# EAGLE design Tricorder-BoosterPack (EAGLE 7.2.0)
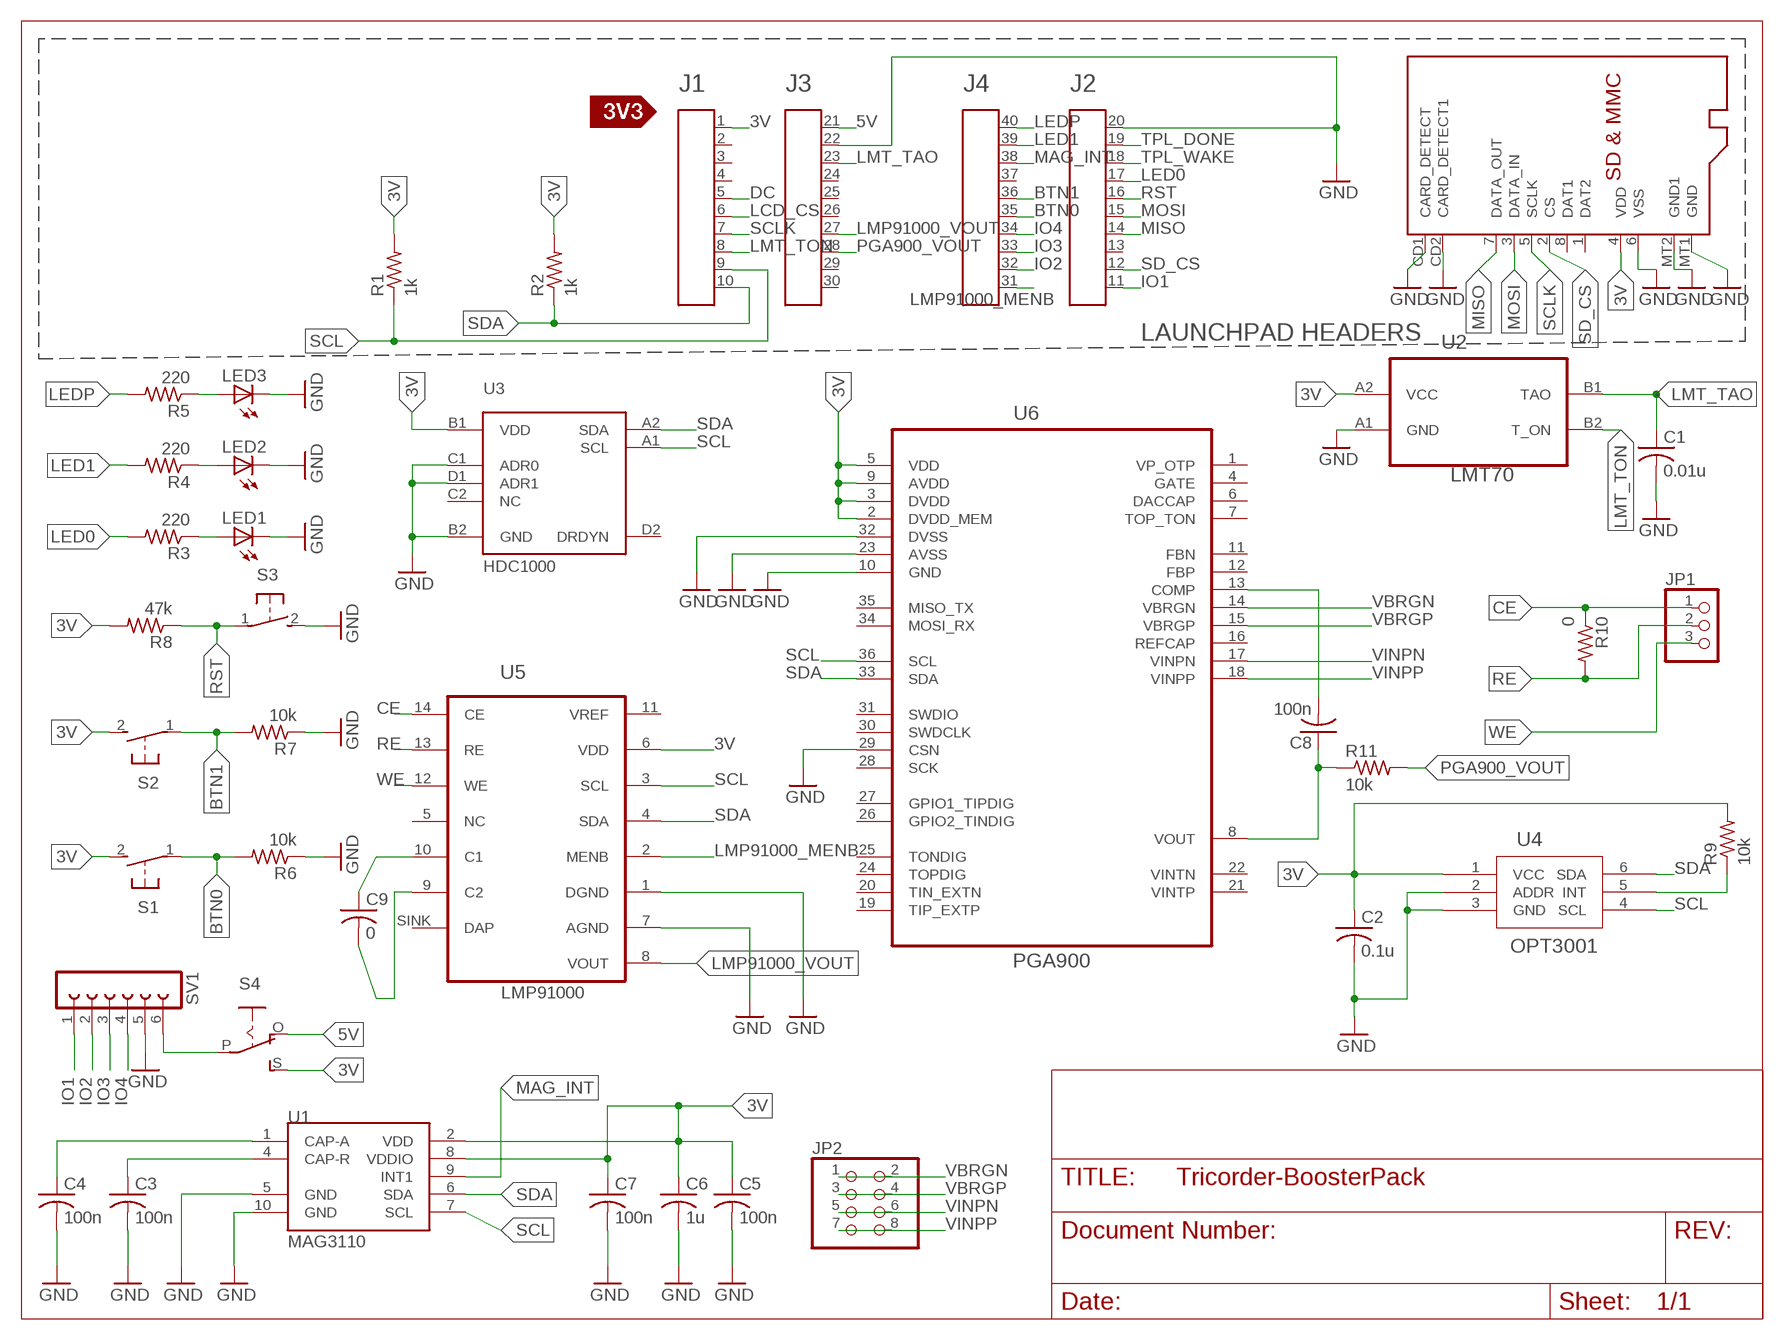
[diagram p0: schematic, sheet 1]

## Parts
A1  HEADER4X10-BOOSTERPACK  [4X10-BOOSTERPACK]
C1  0.01u  C-USC0603  [C0603]
C2  0.1u  C-USC0603  [C0603]
C3  100n  C-USC0603  [C0603]
C4  100n  C-USC0603  [C0603]
C5  100n  C-USC0603  [C0603]
C6  1u  C-USC0603  [C0603]
C7  100n  C-USC0603  [C0603]
C8  100n  C-USC0603  [C0603]
C9  0  C-USC0603  [C0603]
JP1  PINHD-1X3CB  [1X03-CLEANBIG]
JP2  PINHD-2X4  [2X04]
LED1  LEDCHIPLED_0603  [CHIPLED_0603]
LED2  LEDCHIPLED_0603  [CHIPLED_0603]
LED3  LEDCHIPLED_0603  [CHIPLED_0603]
R1  1k  R-US_R0603  [R0603]
R2  1k  R-US_R0603  [R0603]
R3  220  R-US_R0603  [R0603]
R4  220  R-US_R0603  [R0603]
R5  220  R-US_R0603  [R0603]
R6  10k  R-US_R0603  [R0603]
R7  10k  R-US_R0603  [R0603]
R8  47k  R-US_R0603  [R0603]
R9  10k  R-US_R0603  [R0603]
R10  0  R-US_R0603  [R0603]
R11  10k  R-US_R0603  [R0603]
S1  31-XX  [B3F-31XX]
S2  31-XX  [B3F-31XX]
S3  31-XX  [B3F-31XX]
S4  EG1218S  [EG1218]
SV1  FE06-1  [FE06]
U1  MAG3110  [DFN-10]
U2  LMT70LMT70  [BGA4C40P2X2_77X77X50]
U3  HDC1000  [DSBGA_8_YPA]
U4  OPT3001  [DPK6]
U5  LMP91000  [WFDFN-14]
U6  PGA900  [QFN50P600X600X90-37N]
U7  MICROSD  [MICROSD]
U$3  SILK_3V3_TAG  [SILK_3V3_TAG]

## Nets
3V: A1.1 C2.1 C5.1 C6.1 C7.1 R1.2 R2.2 R8.2 R9.2 S1.2(S) S2.2(S) S4.S U1.2(VDD) U1.8(VDDIO) U2.A2(VCC) U3.B1(VDD) U4.1(VCC) U5.6(VDD) U6.2(DVDD_MEM) U6.3(DVDD) U6.5(VDD) U6.9(AVDD) U7.4(VDD)
5V: A1.21 S4.O
BTN0: A1.35 R6.2 S1.1(P)
BTN1: A1.36 R7.2 S2.1(P)
CE: JP1.1 R10.1 U5.14(CE)
DC: A1.5
GND: A1.20 A1.22 C1.2 C2.2 C3.2 C4.2 C5.2 C6.2 C7.2 LED1.C LED2.C LED3.C R6.1 R7.1 S3.2(S) SV1.5 U1.5(GND) U1.10(GND) U2.A1(GND) U3.B2(GND) U3.C1(ADR0) U3.D1(ADR1) U4.2(ADDR) U4.3(GND) U5.1(DGND) U5.7(AGND) U6.10(GND) U6.23(AVSS) U6.29(CSN) U6.32(DVSS) U7.6(VSS) U7.CD1(CARD_DETECT) U7.CD2(CARD_DETECT1) U7.MT1(GND) U7.MT2(GND1)
IO1: A1.11 SV1.1
IO2: A1.32 SV1.2
IO3: A1.33 SV1.3
IO4: A1.34 SV1.4
LCD_CS: A1.6
LED0: A1.17 R3.2
LED1: A1.39 R4.2
LEDP: A1.40 R5.2
LMP91000_MENB: A1.31 U5.2(MENB)
LMP91000_VOUT: A1.27 U5.8(VOUT)
LMT_TAO: A1.23 C1.1 U2.B1(TAO)
LMT_TON: A1.8 U2.B2(T_ON)
MAG_INT: A1.38 U1.9(INT1)
MISO: A1.14 U7.7(DATA_OUT)
MOSI: A1.15 U7.3(DATA_IN)
N$1: LED1.A R3.1
N$2: LED2.A R4.1
N$3: LED3.A R5.1
N$4: S4.P SV1.6
N$5: R9.1 U4.5(INT)
N$7: C9.1 U5.10(C1)
N$8: C3.1 U1.4(CAP-R)
N$9: C4.1 U1.1(CAP-A)
N$10: C8.2 U6.13(COMP)
N$11: C9.2 U5.9(C2)
N$12: C8.1 R11.1 U6.8(VOUT)
PGA900_VOUT: A1.28 R11.2
RE: JP1.2 R10.2 U5.13(RE)
RST: A1.16 R8.1 S3.1(P)
SCL: A1.9 R1.1 U1.7(SCL) U3.A1(SCL) U4.4(SCL) U5.3(SCL) U6.36(SCL)
SCLK: A1.7 U7.5(SCLK)
SD_CS: A1.12 U7.2(CS)
SDA: A1.10 R2.1 U1.6(SDA) U3.A2(SDA) U4.6(SDA) U5.4(SDA) U6.33(SDA)
TPL_DONE: A1.19
TPL_WAKE: A1.18
VBRGN: JP2.1 JP2.2 U6.14(VBRGN)
VBRGP: JP2.3 JP2.4 U6.15(VBRGP)
VINPN: JP2.5 JP2.6 U6.17(VINPN)
VINPP: JP2.7 JP2.8 U6.18(VINPP)
WE: JP1.3 U5.12(WE)
Unconnected: A1.2 A1.3 A1.4 A1.13 A1.24 A1.25 A1.26 A1.29 A1.30 A1.37 U3.C2(NC) U3.D2(DRDYN) U5.5(NC) U5.SINK(DAP) U6.1(VP_OTP) U6.4(GATE) U6.6(DACCAP) U6.7(TOP_TON) U6.11(FBN) U6.12(FBP) U6.16(REFCAP) U6.19(TIP_EXTP) U6.20(TIN_EXTN) U6.21(VINTP) U6.22(VINTN) U6.24(TOPDIG) U6.25(TONDIG) U6.26(GPIO2_TINDIG) U6.27(GPIO1_TIPDIG) U6.28(SCK) U6.30(SWDCLK) U6.31(SWDIO) U6.34(MOSI_RX) U6.35(MISO_TX) U7.1(DAT2) U7.8(DAT1)

## Notes on the sheet
- LAUNCHPAD HEADERS

## Power pins joined to a net without a drawn wire
VREF: U5.11(VREF)

## Library data of the parts
A1 = Public_BP_Library:HEADER4X10-BOOSTERPACK
C1-C9 = adafruit:C-US: CAPACITOR, American symbol
JP1 = adafruit:PINHD-1X3: PIN HEADER
JP2 = adafruit:PINHD-2X4: PIN HEADER
LED1-LED3 = adafruit:LED: LED OSRAM: - CHIPLED LG R971, LG N971, LY N971, LG Q971, LY Q971, LO R971, LY R971 LH N974, LH R974 LS Q976, LO Q976, LY Q976 LO Q996 - Hyper CHIPLED LW Q18S LB Q993, LB Q99A, LB R99A - SideLED LS A670, LO A670, LY A670, LG A670, LP A670 LB A673, LV A673, LT A673, LW A673 LH A674 LY A675 LS A676, LA A676, LO A676, LY A676, LW A676 LS A679, LY A679, LG A679 - Hyper Micro SIDELED® LS Y876, LA Y876, LO Y876, LY Y876 LT Y87S - SmartLED LW L88C, LW L88S LB L89C, LB L89S, LG L890 LS L89K, LO L89K, LY L89K LS L896, LA L896, LO L896, LY L896 - TOPLED LS T670, LO T670, LY T670, LG T670, LP T670 LSG T670, LSP T670, LSY T670, LOP T670, LYG T670 LG T671, LOG T671, LSG T671 LB T673, LV T673, LT T673, LW T673 LH T674 LS T676, LA T676, LO T676, LY T676, LB T676, LH T676, LSB T676, LW T676 LB T67C, LV T67C, LT T67C, LS T67K, LO T67K, LY T67K, LW E67C LS E67B, LA E67B, LO E67B, LY E67B, LB E67C, LV E67C, LT E67C LW T67C LS T679, LY T679, LG T679 LS T770, LO T770, LY T770, LG T770, LP T770 LB T773, LV T773, LT T773, LW T773 LH T774 LS E675, LA E675, LY E675, LS T675 LS T776, LA T776, LO T776, LY T776, LB T776 LHGB T686 LT T68C, LB T68C - Hyper Mini TOPLED® LB M676 - Mini TOPLED Santana® LG M470 LS M47K, LO M47K, LY M47K Source: http://www.osram.convergy.de/
R1-R11 = resistor:R-US_: RESISTOR, American symbol
S1-S3 = adafruit:31-XX: OMRON SWITCH Now with beefier pads!
S4 = adafruit:EG1218: SLIDING SWITCH 0.1" spacing through hole, vertical SPDT slide switch http://www.ladyada.net/library/pcb/eaglelibrary.html
SV1 = con-lsta:FE06-1: FEMALE HEADER; OC_FARNELL: unknown; OC_NEWARK: unknown
U1 = SparkFun-Sensors:MAG3110: 3-axis digital (I2C) magnetometer
U2 = LMT70:LMT70: LOW-POWER SINGLE INVERTER GATE; MPN: LMT70; OC_FARNELL: -; OC_NEWARK: 50R7866; PACKAGE: BGA-4; SUPPLIER: Texas Instruments
U3 = Fra:HDC1000
U4 = OPT3001_GOOD:OPT3001; DATASHEETURL: http://www.ti.com/lit/gpn/TPD4E001; DESCRIPTION: Low-Capacitance 4-Channel +/-15-kV ESD Protection Array for High-Speed Data Interfaces; FAMILY_NAME: ESD Solution; GENERIC_PART_NUMBER: TPD4E001; INDUSTRY_STD_PKG_TYPE: USON; MANUFACTURER: Texas Instruments; MANUFACTURER_PART_NUMBER: tpd4e001_dpk_6; PACKAGE_DESIGNATOR: DPK; PIN_COUNT: 6; VENDOR: Texas Instruments
U5 = LMP91000:LMP91000: IC TI AFE for Gas Sensing; DIGIKEY: LMP91000
U6 = PGA900:PGA900: Resistive Sensor Interface; MPN: PGA900; PACKAGE: QFN-36; SUPPLIER: TEXAS INSTRUMENTS
U7 = adafruit:MICROSD: Micro-SD / Transflash card holder with SPI pinout For the 3M # 2908-05WB-MG and/or 4UCON #19656 push-push type
U$3 = Public_BP_Library:SILK_3V3_TAG

## Net classes
0 default: width 0.15 mm, drill 0.508 mm, clearance 0.001 mm

## Board
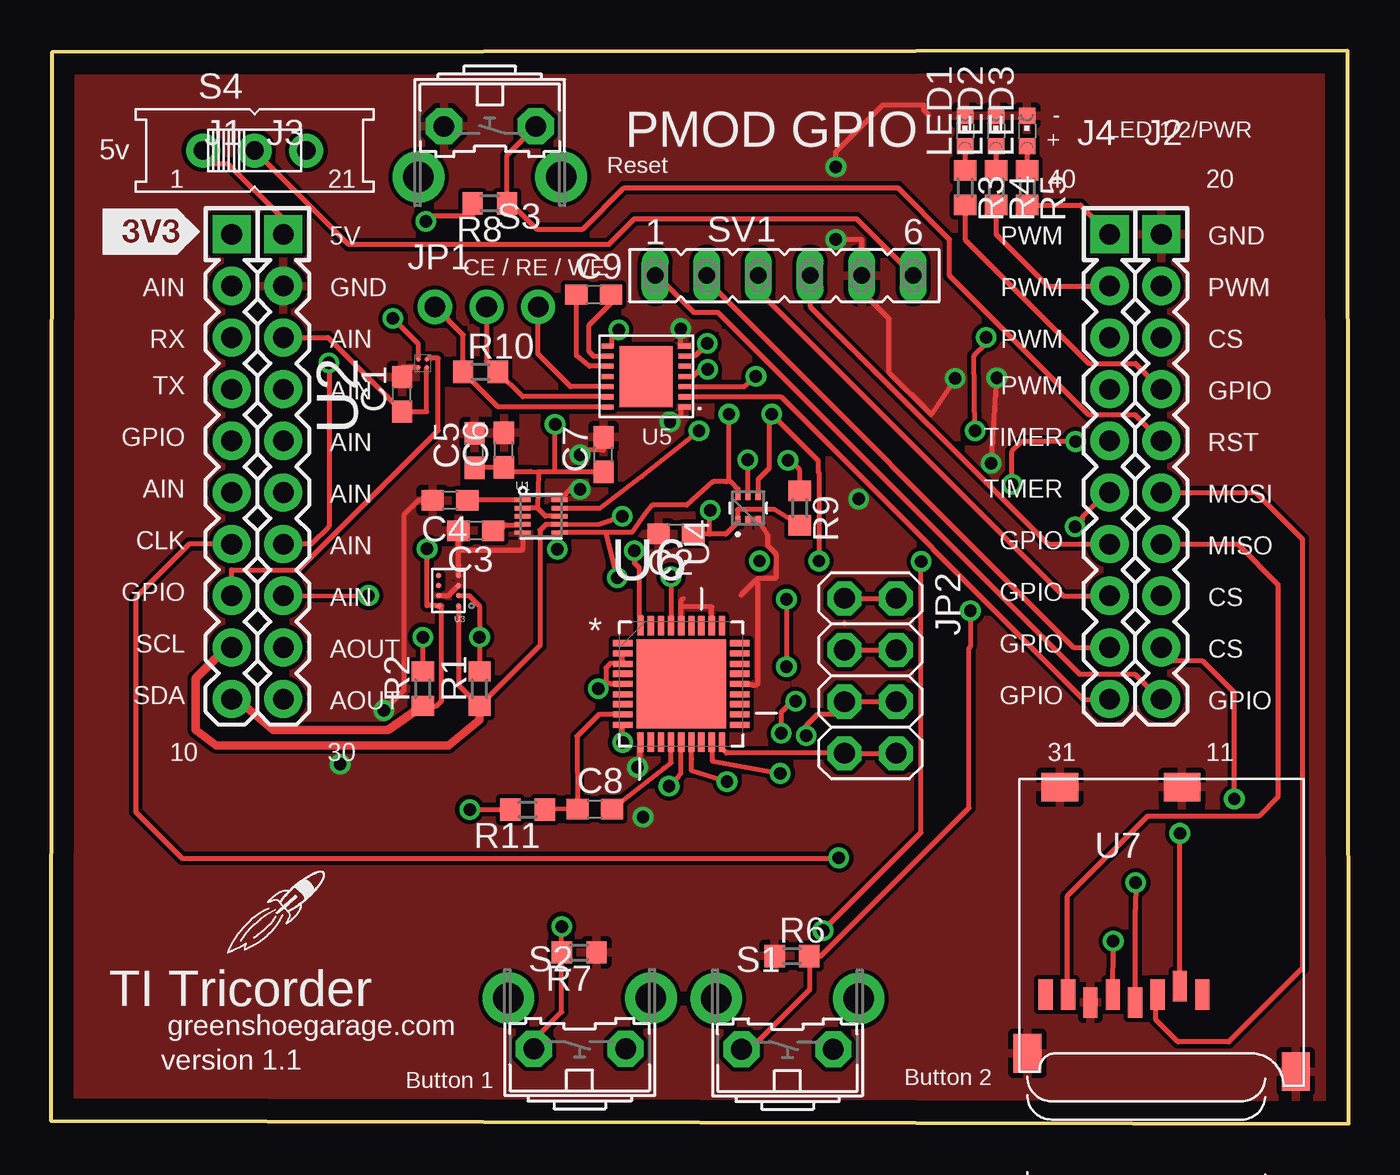
[diagram p1: board, top side]
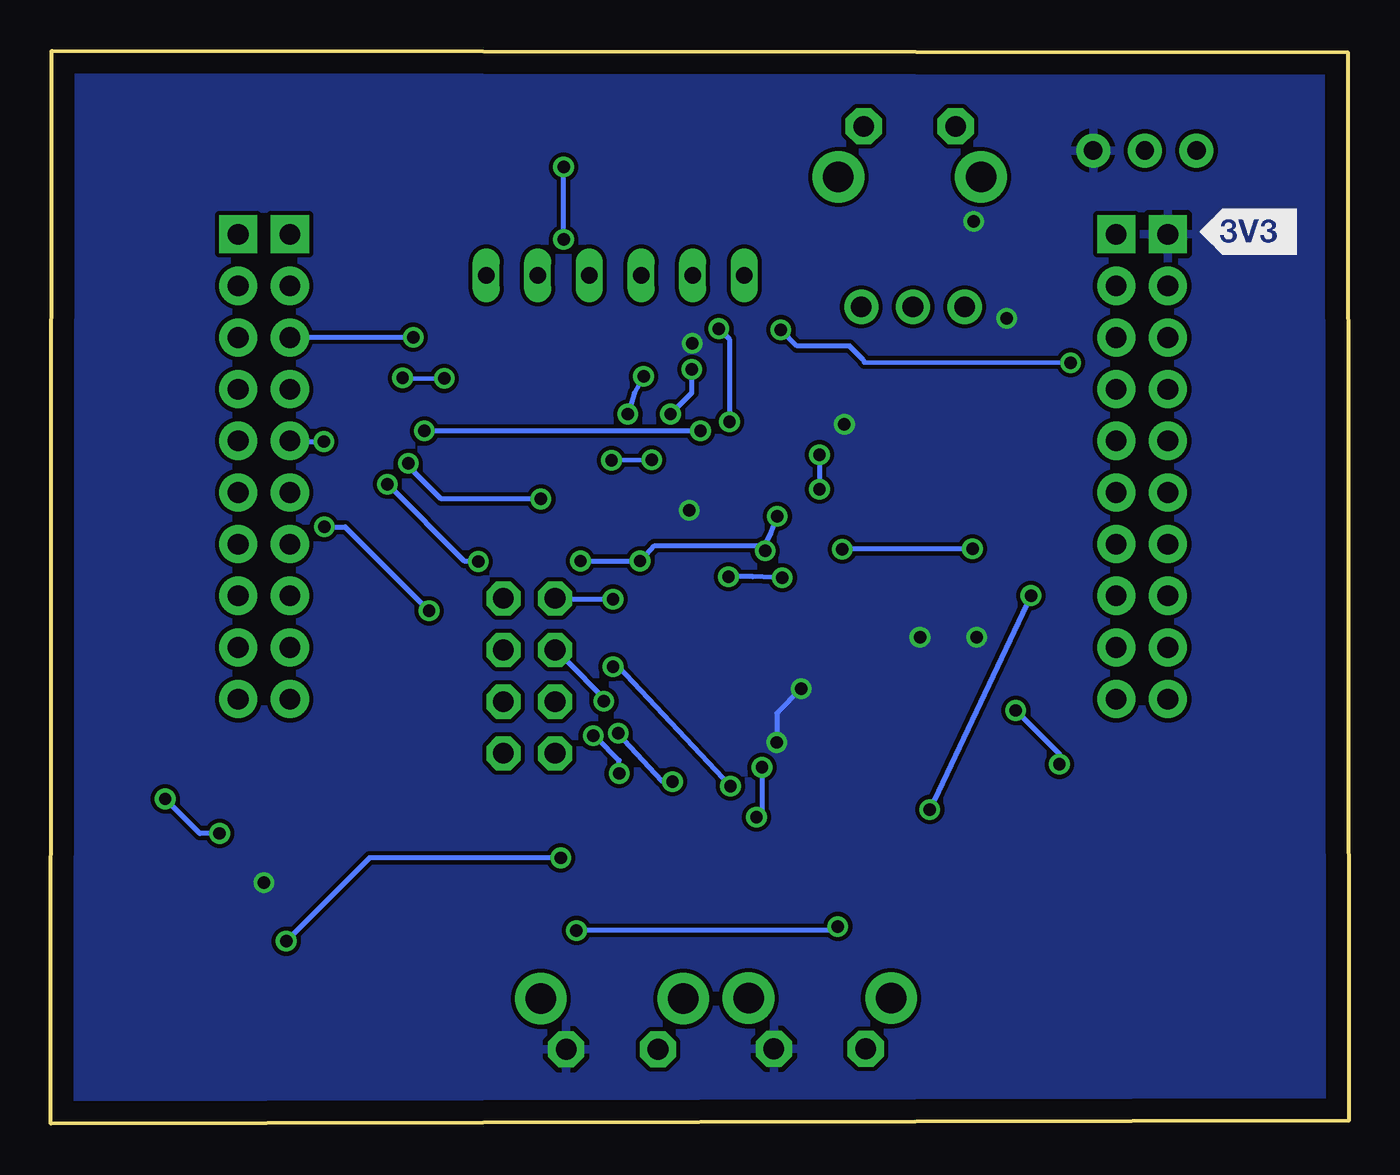
[diagram p2: board, bottom side, seen from below]

Size 63.82 x 52.77 mm. Coordinates in mm from the lower left corner, seen from the top.
Outline: 0,0.15 63.82,0 63.77,52.77 0.05,52.69 0,0.15
Copper layers (1*16): Top 0.035mm / dielectric 1.5mm / Bottom 0.035mm
Design rules "default": minimum track width 10mil, minimum drill 24mil, track to track 8mil, track to pad 8mil, pad to pad 8mil, via to via 8mil, smd to smd 8mil, copper to edge 40mil, drill to drill 8mil, minimum pad ring 10mil, minimum via ring 8mil, stop-mask expansion 4mil, vias tented up to drill 0mil, thermal gap 10mil

### Footprints (pad centres in the part's own frame; a part is rotated, then mirrored left to right if it is on the bottom)
4X10-BOOSTERPACK = drill 1.016 pad 1.88 square: 1 0,10.16; 20 45.72,10.16; 21 2.54,10.16; 40 43.18,10.16 | drill 1.016 pad 1.88: 2 0,7.62; 3 0,5.08; 4 0,2.54; 5 0,0; 6 0,-2.54; 7 0,-5.08; 8 0,-7.62; 9 0,-10.16; 10 0,-12.7; 11 45.72,-12.7; 12 45.72,-10.16; 13 45.72,-7.62; 14 45.72,-5.08; 15 45.72,-2.54; 16 45.72,0; 17 45.72,2.54; 18 45.72,5.08; 19 45.72,7.62; 22 2.54,7.62; 23 2.54,5.08; 24 2.54,2.54; 25 2.54,0; 26 2.54,-2.54; 27 2.54,-5.08; 28 2.54,-7.62; 29 2.54,-10.16; 30 2.54,-12.7; 31 43.18,-12.7; 32 43.18,-10.16; 33 43.18,-7.62; 34 43.18,-5.08; 35 43.18,-2.54; 36 43.18,0; 37 43.18,2.54; 38 43.18,5.08; 39 43.18,7.62
C0603 = smd 1.1 x 1: 1 -0.85,0; 2 0.85,0
1X03-CLEANBIG = drill 1.016 pad 1.676: 1 -2.54,0; 2 0,0; 3 2.54,0
2X04 = drill 1.016 pad 1.676 octagon: 1 -3.81,-1.27; 2 -3.81,1.27; 3 -1.27,-1.27; 4 -1.27,1.27; 5 1.27,-1.27; 6 1.27,1.27; 7 3.81,-1.27; 8 3.81,1.27
CHIPLED_0603 = smd 0.8 x 0.8: A 0,-0.75; C 0,0.75
R0603 = smd 1 x 1.1: 1 -0.85,0; 2 0.85,0
B3F-31XX = drill 1.016 pad 1.778 octagon: 1 -2.261,-1.245; 2 2.261,-1.245 | drill 1.499 pad 2.54: 3 -3.505,1.245; 4 3.505,1.245
EG1218 = drill 0.9 pad 1.676: O -2.54,0; P 0,0; S 2.54,0
FE06 = drill 0.813 long: 1 -6.35,0; 2 -3.81,0; 3 -1.27,0; 4 1.27,0; 5 3.81,0; 6 6.35,0
DFN-10 = smd 0.8 x 0.22: 1 -0.91,0.8; 2 -0.91,0.4; 3 -0.91,0; 4 -0.91,-0.4; 5 -0.91,-0.8; 6 0.91,-0.8; 7 0.91,-0.4; 8 0.91,0; 9 0.91,0.4; 10 0.91,0.8
BGA4C40P2X2_77X77X50 = smd 0.203 x 0.203: A1 -0.203,0.203; A2 0.203,0.203; B1 -0.203,-0.203; B2 0.203,-0.203
DSBGA_8_YPA = smd 0.275 x 0.275: A1 -0.5,0.75; A2 0.5,0.75; B1 -0.5,0.25; B2 0.5,0.25; C1 -0.5,-0.25; C2 0.5,-0.25; D1 -0.5,-0.75; D2 0.5,-0.75
DPK6 = smd 0.406 x 0.254: 1 -0.6,0.5; 2 -0.6,0; 3 -0.6,-0.5; 4 0.6,-0.5; 5 0.6,0; 6 0.6,0.5
WFDFN-14 = smd 0.25 x 0.6: 1 -1.5,-1.9; 2 -1,-1.9; 3 -0.5,-1.9; 4 0,-1.9; 5 0.5,-1.9; 6 1,-1.9; 7 1.5,-1.9; 8 1.5,1.9; 9 1,1.9; 10 0.5,1.9; 11 0,1.9; 12 -0.5,1.9; 13 -1,1.9; 14 -1.5,1.9 | smd 3 x 2.6: SINK 0,0
QFN50P600X600X90-37N = smd 0.965 x 0.305: 1 -2.87,2.007; 2 -2.87,1.499; 3 -2.87,0.991; 4 -2.87,0.508; 5 -2.87,0; 6 -2.87,-0.508; 7 -2.87,-0.991; 8 -2.87,-1.499; 9 -2.87,-2.007; 19 2.87,-2.007; 20 2.87,-1.499; 21 2.87,-0.991; 22 2.87,-0.508; 23 2.87,0; 24 2.87,0.508; 25 2.87,0.991; 26 2.87,1.499; 27 2.87,2.007 | smd 0.305 x 0.965: 10 -2.007,-2.87; 11 -1.499,-2.87; 12 -0.991,-2.87; 13 -0.508,-2.87; 14 0,-2.87; 15 0.508,-2.87; 16 0.991,-2.87; 17 1.499,-2.87; 18 2.007,-2.87; 28 2.007,2.87; 29 1.499,2.87; 30 0.991,2.87; 31 0.508,2.87; 32 0,2.87; 33 -0.508,2.87; 34 -0.991,2.87; 35 -1.499,2.87; 36 -2.007,2.87 | smd 4.394 x 4.394: 37 0,0
MICROSD = smd 0.7 x 1.5: 1 9,-10.64; 2 7.9,-10.24; 3 6.8,-10.64; 4 5.7,-11.04; 5 4.6,-10.64; 6 3.5,-11.04; 7 2.4,-10.64; 8 1.3,-10.64 | smd 1.8 x 1.4: CD1 2,-0.44; CD2 8,-0.44 | smd 1.4 x 1.9: MT1 0.4,-13.54; MT2 13.6,-14.44

### Placement (x,y rotation side)
A1  8.89,33.59 0 top
C1  17.27,35.87 90 top
C2  30.73,29.01 180 top
C3  20.9,29.16 180 top
C4  19.62,30.65 180 top
C5  20.84,33.1 90 top
C6  22.28,33.14 90 top
C7  27.18,32.91 90 top
C8  26.75,15.47 0 top
C9  26.7,40.77 0 top
JP1  21.42,40.18 0 top
JP2  40.3,22.03 270 top
LED1  44.96,48.83 0 top
LED2  46.48,48.83 0 top
LED3  48.01,48.83 0 top
R1  21.08,21.39 90 top
R2  18.29,21.39 90 top
R3  44.96,46.03 270 top
R4  46.48,46.03 270 top
R5  48.01,46.03 270 top
R6  36.45,8.25 0 top
R7  25.98,8.42 180 top
R8  21.59,45.27 180 top
R9  36.83,30.28 270 top
R10  21.12,36.98 0 top
R11  23.45,15.45 180 top
S1  36.22,4.91 0 top
S2  26.01,4.93 0 top
S3  21.59,47.81 180 top
S4  10.02,47.86 0 top
SV1  36.07,41.71 0 top
U1  24.11,29.88 0 top
U2  18.29,37.4 90 top
U3  19.56,26.22 180 top
U4  34.29,30.28 90 top
U5  29.27,36.75 90 top
U6  31,21.62 0 top
U7  47.62,17 0 top
U$2  [LOGO-ROCKET]  11.22,10.58 0 top
U$3  2.54,42.73 0 top

### Tracks (layer width: path | path; a pad name or v marks a point on that pad's centre or on a via)
3V  (via drill 0.61)
  Top 0.254: 21.08,22.16 R1.2 v21.08,23.93 21.08,25.46 20.57,25.97 U3.B1 | v18.29,23.93 R2.2 | 20.83,45.27 R8.2 20.75,45.15 20.75,44.62 18.72,44.62 18.45,44.35 v18.45,44.38 | 36.83,29.52 R9.2 | 36.8,29.48 R9.2 | U5.6 31.57,37.75 31.62,37.8 31.73,37.8 32.27,38.35 v32.27,38.38 | U6.2 28.12,23.1 U6.3 28,22.62 27.5,22.62 27.3,22.43 27.3,21.7 | 27.3,21.7 27.32,21.68 27.47,21.68 27.52,21.62 U6.5 | v28.12,18.75 28.12,19.6 U6.9 | v26.92,21.4 27.17,21.65 27.3,21.7 | U7.4 53.32,10.5 v53.35,11.85 | C5.1 20.88,32.29 C6.1 22.49,32.08 23.6,32.08 23.97,32.05 | U1.8 24.32,29.88 23.92,30.28 | 23.92,30.28 U1.2 | 23.97,32.05 23.92,30.28 | C7.1 26.72,32.05 24.8,32.05 | 24.8,32.05 23.97,32.05 | 24.8,32.05 v24.8,34.4 24.8,34.75 | 32.4,29 33.2,29 33.79,29.59 U4.1 33.79,30.09 33.77,30.23 35.56,30.23 R9.2 | 32.4,29 31.6,29 C2.1 | 32.4,29 32.4,30 32.42,30.03 v32.42,30.18 | U2.A2 18.08,38.34 v16.82,39.6
  Bottom 0.254: v28.12,18.75 28.12,20.2 v26.92,21.4
  pour Bottom: -0.63,53.77 -0.63,0.01 64.24,-0.01 64.31,53.75
5V
  Top 0.254: A1.21 11.43,43.88 11.43,44.5 8.7,47.23 7.47,47.23 S4.O
BTN0  (via drill 0.61)
  Top 0.254: 52.07,31.03 A1.35 51.95,31.05 50.73,29.83 50.73,29.7 v50.38,29.35 | S1.1 34.39,3.66 37.32,6.6 37.32,8.22 R6.2 37.88,8.25 45.15,15.53 45.15,23.38 45.17,23.4 45.23,23.53 v45.23,25.23
  Bottom 0.254: v45.23,25.23 49.35,29.35 v50.38,29.35
BTN1  (via drill 0.61)
  Top 0.254: S2.1 23.75,4.32 23.95,4.32 25.12,5.5 R7.2 25.12,8.55 v25.12,9.7 | v50.4,33.55 47.75,33.55 47.27,33.08 v47.27,31.45 | v42.8,27.65 42.8,14.32 v37.98,9.5
  Bottom 0.254: v50.4,33.55 51.17,33.55 51.2,33.58 52.05,33.58 A1.36 | v47.27,31.45 43.48,27.65 v42.8,27.65 | v37.98,9.5 25.32,9.5 v25.12,9.7
CE
  Top 0.254: U5.14 22,35.25 R10.1 20.27,38.79 JP1.1
GND  (via drill 0.61)
  Top 0.254: 43.18,49.59 42.93,49.84 42.93,50.09 40.89,50.09 38.61,47.81 v38.61,47.05 | v38.61,43.49 39.88,43.49 SV1.5 39.88,41.6 39.88,40.95 41.23,39.6 41.23,36.95 43.3,34.88 v44.48,36.65 | U2.A1 17.27,37.19 C1.2 | 29.95,28.98 C2.2 | 34.66,26.71 34.77,26.83 35.65,26.83 35.65,28.03 35.25,28.43 35.25,28.98 U4.3 U4.2 | 34.66,26.71 33.95,26 | U6.32 31,25.4 | 31,25.4 31,25.73 31.1,25.83 | U6.23 34.2,21.62 34.23,21.6 34.5,21.6 34.52,21.58 34.67,21.58 34.7,21.6 34.75,21.6 34.75,26.62 34.66,26.71 | v28.85,17.53 28.95,17.62 28.95,18.25 29,18.3 U6.10 | 39.05,24.65 39.05,24.59 | v46.25,32.48 v46.52,36.68 | U3.D1 20.06,27.47 20.05,28.22 | 20.05,28.22 C3.2 | U3.B2 19.56,25.97 U3.C1 | v26.02,31.2 25.92,31.2 25.8,31.33 25.67,31.33 U1.10 | v26.02,32.9 26.25,33.12 27.17,33.12 C7.2 | v14.22,17.68 14.22,17.5 | v16.38,20.33 17.35,21.3 17.35,29.93 18.07,30.65 18.75,30.65 C4.2 | U1.5 23.2,28.25 23.15,28.2 20.08,28.2 20.05,28.22 | U6.29 32.5,25.43 31,25.4 | U5.1 30.98,35.25 30.98,34.85 30.65,34.52 v30.45,34.52 | v30.98,39.1 30.98,38.25 U5.7
  Bottom 0.254: v38.61,43.49 v38.61,47.05 | v29.12,15.07 29.1,15.07 28.85,15.32 v28.85,17.53 | v46.52,36.68 v44.48,36.65 | v46.25,32.48 45.95,32.18 45.95,32.05 44.62,30.73 v39.73,30.73 | v26.02,32.9 v26.02,31.2 | v14.22,17.68 14.22,18.18 v16.38,20.33 | v30.45,34.52 30.45,38.58 v30.98,39.1
  pour Top: -0.58,53.75 -0.58,0.06 64.29,0.14 64.26,53.67
IO1
  Top 0.254: A1.11 54.54,20.89 53.32,22.1 50.6,22.1 32.8,39.9 31.62,39.9 29.81,41.71 SV1.1
IO2
  Top 0.254: SV1.2 32.26,41.46 50.29,23.43 A1.32
IO3
  Top 0.254: SV1.3 34.8,40.95 49.78,25.96 A1.33
IO4
  Top 0.254: SV1.4 37.34,40.19 49.02,28.51 A1.34
LED0
  Top 0.254: R3.2 44.96,43.49 51.05,37.4 53.34,37.4 A1.17
LED1
  Top 0.254: R4.2 46.48,43.75 49.02,41.2 A1.39
LEDP
  Top 0.254: R5.2 50.63,45.18 A1.40
LMP91000_MENB
  Top 0.254: U5.2 35.9,35.75 50.77,20.88 52.06,20.88 A1.31
LMP91000_VOUT  (via drill 0.61)
  Top 0.254: v13.68,37.43 13.68,29.38 12.8,28.5 A1.27 | U5.8 27.57,38.25 27.57,38.7 v27.92,39.05
  Bottom 0.254: v13.68,37.43 23.82,37.45 23.88,37.58 24.55,38.25 27.12,38.25 v27.92,39.05
LMT_TAO
  Top 0.254: U2.B1 18.49,35.02 C1.1 13.63,38.66 A1.23
LMT_TON
  Top 0.254: A1.8 8.89,27.24 12.19,27.24 19.05,34.09 19.05,37.65 18.54,37.65 U2.B2
MAG_INT  (via drill 0.61)
  Top 0.254: v45.45,34.08 45.4,37.77 46,38.38 v46,38.68 | U1.9 27,30.28 28.12,31.12 29.05,31.83 v31.88,34.08
  Bottom 0.254: v31.88,34.08 v45.45,34.08 | v46,38.68 52,38.68 A1.38
MISO
  Top 0.254: A1.14 58.37,28.51 60.35,26.53 60.35,16.08 59.4,15.12 53.92,15.12 49.98,11.17 49.98,6.41 U7.7
MOSI
  Top 0.254: A1.15 59.25,31.05 61.55,28.75 61.55,7.65 57.92,4.02 55.42,4.02 54.35,5.1 54.35,6.28 U7.3
N$1
  Top 0.254: LED1.A R3.1
N$2
  Top 0.254: LED2.A R4.1
N$3
  Top 0.254: LED3.A R5.1
N$4
  Top 0.254: SV1.6 39.62,44.51 28.7,44.51 27.43,43.24 14.65,43.24 S4.P
N$5  (via drill 0.61)
  Top 0.254: 36.9,31.28 37,31.18 36.9,31.08 R9.1 | R9.1 36.83,31.17 | 34.3,30.89 U4.5 34.29,32.55 | R9.1 36.83,32.15 36.3,32.68 36.17,32.62 v36.25,32.62 | 34.29,32.55 34.29,32.66 34.3,32.68 | v34.27,32.65 34.29,32.55
  Bottom 0.254: v34.27,32.65 v36.25,32.62
N$7
  Top 0.254: U5.10 26.47,37.25 25.85,37.77 C9.1
N$8
  Top 0.254: C3.1 22.3,29.4 22.35,29.45 23.17,29.45 U1.4
N$9
  Top 0.254: U1.1 20.5,30.68 C4.1
N$10
  Top 0.254: C8.2 30.15,17.48 30.5,17.75 U6.13
N$11
  Top 0.254: C9.2 27.55,40.35 26.45,39.25 26.45,38 26.7,37.75 U5.9
N$12
  Top 0.254: U6.8 26.95,20.13 25.88,19.05 C8.1 R11.1
PGA900_VOUT  (via drill 0.61)
  Top 0.254: v20.6,15.45 R11.2 | A1.28 v15.63,25.98
  Bottom 0.254: v15.63,25.98 v20.6,15.45
RE
  Top 0.254: JP1.2 21.42,37.52 R10.2 23.2,35.75 U5.13
RST
  Top 0.254: S3.1 22.44,47.64 R8.1 22.61,45.27 23.88,44 26.16,44 28.19,46.03 41.66,46.03 44.2,43.49 44.2,41.71 51.05,34.86 53.34,34.86 A1.16
SCL  (via drill 0.61)
  Top 0.22: 26.95,29.48 U1.7
  Top 0.254: A1.9 8.64,23.43 | U3.A1 20.06,21.57 R1.1 24.05,23.51 24.05,29.18 24.35,29.48 U1.7 | v37.77,27.68 37.77,32 37.75,32.02 37.75,32.6 v35.45,34.9 35.32,34.85 35.32,32.23 34.8,31.7 34.8,30.9 U4.4 | 26.95,29.48 27.4,29.62 v28.1,29.88 | v34.67,36.75 34.1,36.25 U5.3 | U6.36 29,24.95 28.95,25 28.95,27.33 28.7,27.58 v28.7,28.18
  Top 0.406: 8.64,23.43 7.11,21.9 7.11,19.36 8.13,18.6 19.56,18.6 21.08,19.87 R1.1
  Bottom 0.254: v37.77,27.68 v34.85,27.68 34.73,27.78 34.12,28.43 28.7,28.43 | v28.1,29.88 28.42,29 28.7,28.43 | v35.45,34.9 35.12,35.95 v34.67,36.75 | v28.7,28.18 28.7,28.43
SCLK  (via drill 0.61)
  Top 0.254: U7.5 v52.25,8.97 | A1.7 6.8,28.51 4.18,25.88 4.18,15.32 6.45,13.05 38.73,13.05 v38.75,13.07
  Bottom 0.254: v38.75,13.07 48.15,13.07 v52.25,8.97
SD_CS  (via drill 0.61)
  Top 0.254: A1.12 54.6,23.43 54.6,22.78 56.62,22.78 58.2,21.2 v58.2,15.97 | U7.2 v55.52,14.28
  Bottom 0.254: v58.2,15.97 56.5,14.28 v55.52,14.28
SDA  (via drill 0.61)
  Top 0.254: A1.10 9.14,20.89 | R2.1 18.5,20.58 18.5,20.55 18.97,20.55 19.22,20.8 19.22,25.48 19.07,25.48 U3.A2 18.92,25.48 18.5,25.48 v18.5,28.28 | v24.9,28.25 24.9,29 U1.6 27.27,29.08 | U5.4 31.57,36.75 31.82,37 32.17,37 32.3,37.12 v32.3,37.1 | 33.35,31.6 v33.35,34.9 | 27.27,29.08 28.57,29.08 29.17,29.93 29.57,30.43 31.27,30.43 32.57,31.58 33.23,31.58 33.35,31.6 | v30.5,26.9 U6.33 | 27.27,29.08 v27.85,26.85 | 33.35,31.6 33.48,31.55 33.8,31.23 33.8,30.9 U4.6
  Top 0.406: 9.14,20.89 10.92,19.36 16.6,19.36 R2.1
  Bottom 0.254: v24.9,28.25 24.88,28.28 v18.5,28.28 | v32.3,37.1 32.3,35.95 v33.35,34.9 | v30.5,26.9 29.3,26.9 v27.85,26.85
VBRGN  (via drill 0.61)
  Top 0.254: JP2.1 JP2.2 | U6.14 31,18.55 30.98,18.53 30.98,17.23 30.85,17.05 v30.4,16.6 | v36.17,25.8 v36.17,22.48
  Bottom 0.254: v30.4,16.6 35.92,22.48 v36.17,22.48 | v36.17,25.8 38.3,25.8 38.32,25.83 JP2.1
VBRGP  (via drill 0.61)
  Top 0.254: JP2.3 JP2.4 | v35.92,19.2 35.92,20.25 36.62,20.95 v36.62,20.78 | v33.25,16.83 31.5,17.38 31.51,17.93 U6.15
  Bottom 0.254: v36.62,20.78 36.62,20.93 38.5,22.8 38.5,23.3 JP2.3 | v33.25,16.83 33.77,16.85 v35.92,19.2
VINPN  (via drill 0.61)
  Top 0.254: JP2.6 JP2.5 39.02,20.65 39.02,20.12 37.7,20.12 37.15,19.58 v37.15,19.08 | v35.88,17.23 32.52,17.85 32.52,18.75 U6.17
  Bottom 0.254: v37.15,19.08 37.05,18.98 36.98,18.98 35.88,17.88 v35.88,17.23
VINPP
  Top 0.254: JP2.8 JP2.7 33.23,18.23 33.01,18.44 U6.18
WE
  Top 0.254: U5.12 25.55,36.25 23.95,37.85 23.95,40.16 JP1.3

### Text on the board
tPlace: PMOD GPIO | - / + | LED 1/2/PWR | 5v | Reset | CE / RE / WE | TI Tricorder | greenshoegarage.com | version 1.1 | Button 1 | Button 2